# Altium project Bison-Board-PCB-V1.4.PrjPcb
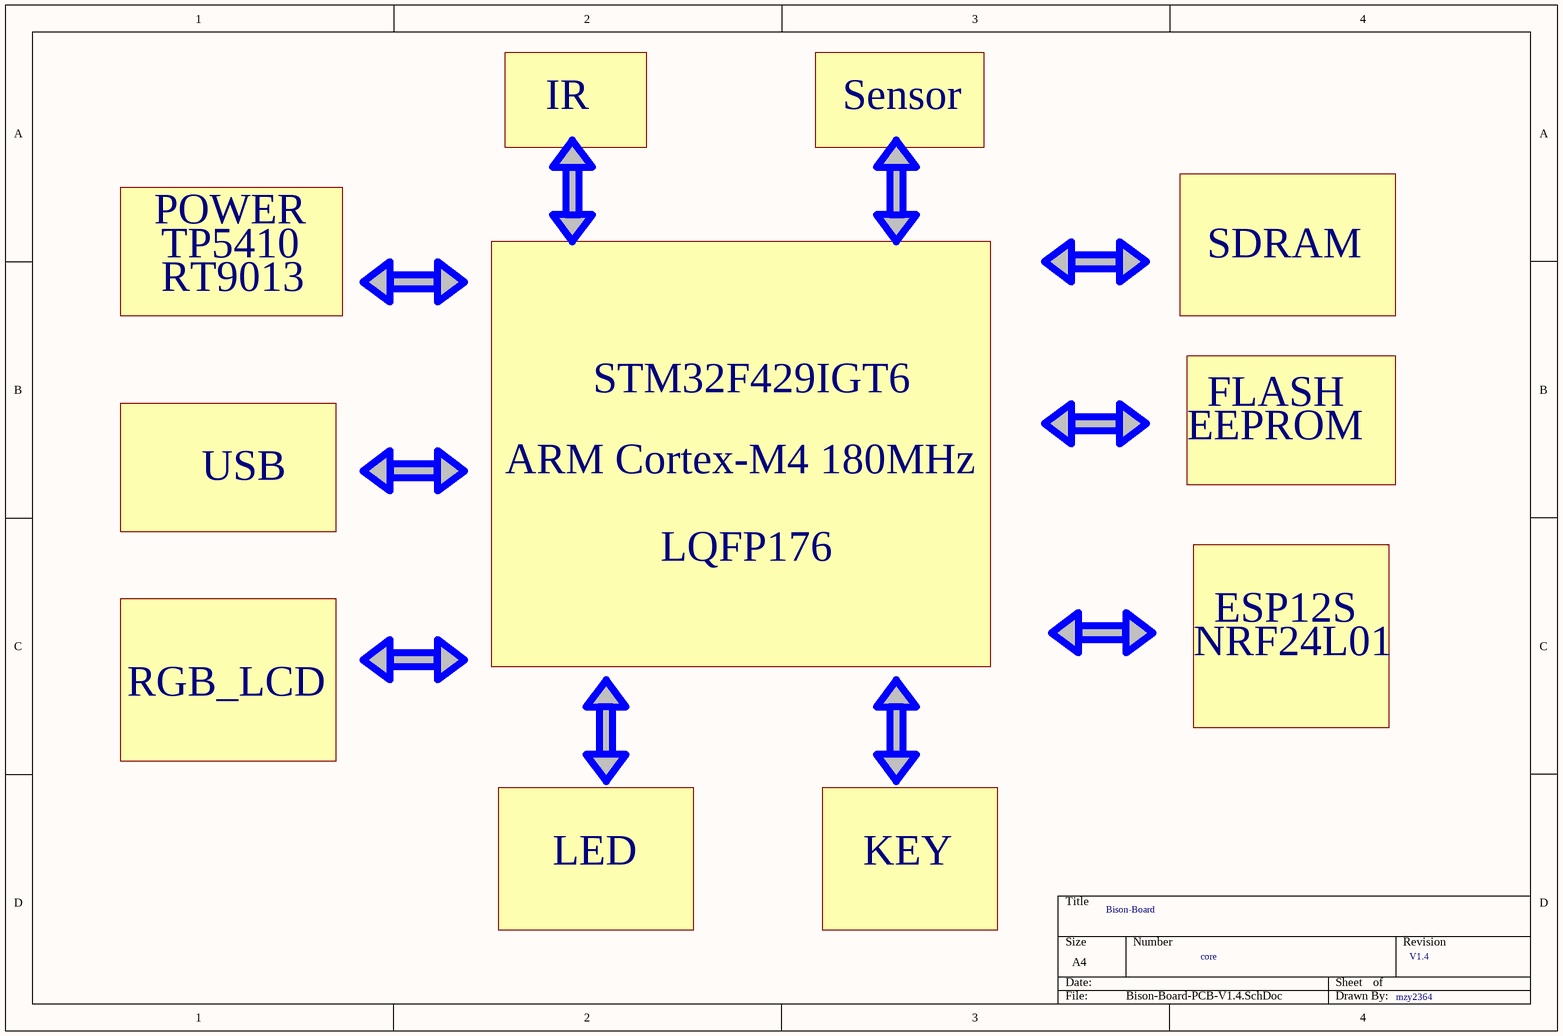
[diagram p0: Bison-Board-PCB-V1.4.SchDoc]
10 sheets, 213 parts. Net scope: global (net labels, ports and power ports of the same name join across sheets).
Board files: Bison-Board-PCB-V1.4.PcbDoc, Bison-Board-PCB-V1.4-sample.PcbDoc
Sheets:
  Bison-Board-PCB-V1.4.SchDoc
  MCU.SchDoc
  POWER.SchDoc
  USB.SchDoc
  SDRAM.SchDoc
  memory.SchDoc
  LCD.SchDoc
  wireless.SchDoc
  sensor.SchDoc
  connect.SchDoc

## Sheet Bison-Board-PCB-V1.4.SchDoc: Bison-Board
size A4; DrawnBy: mzy2364; Revision: V1.4

### Notes on the sheet
- IR
- Sensor
- POWER
- TP5410
- RT9013
- SDRAM
- STM32F429IGT6
- EEPROM
- FLASH
- USB
- ARM Cortex-M4 180MHz
- LQFP176
- ESP12S
- RGB_LCD
- NRF24L01
- LED
- KEY
- core

## Sheet MCU.SchDoc: Bison-Board
size A4; DrawnBy: mzy2364; Revision: V1.4
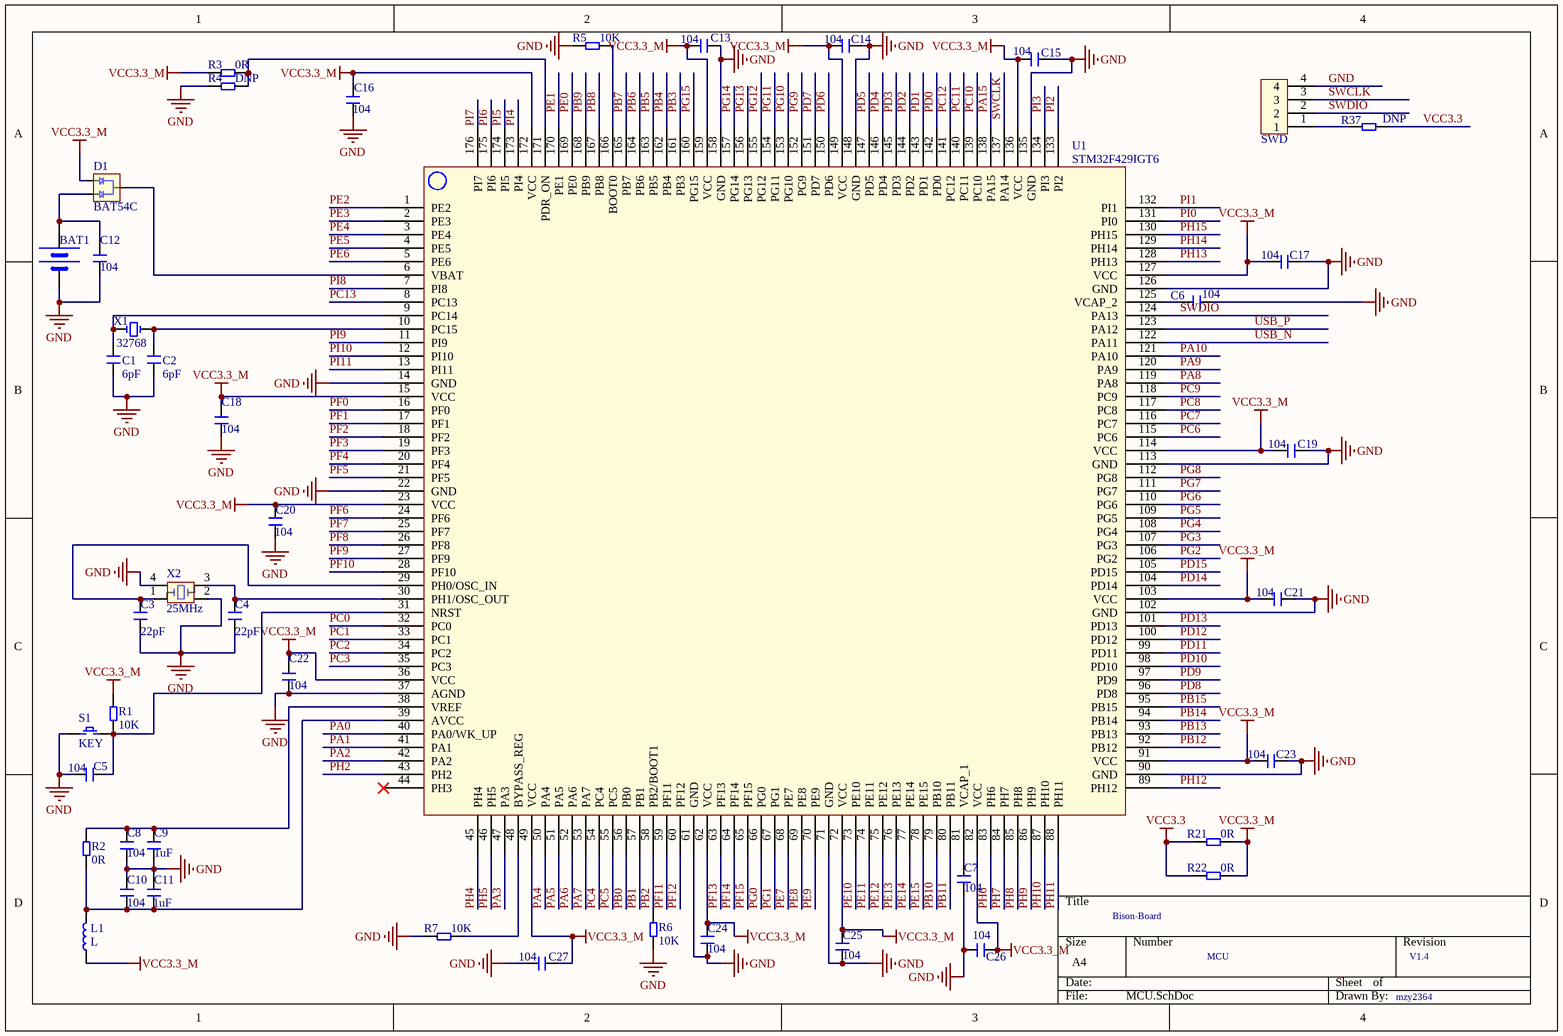
[diagram p1: MCU.SchDoc]

### Parts
BAT1  BATTERY  [SBAT-1220]  (value not drawn)
C1  6pF  [C 0603]
C2  6pF  [C 0603]
C3  22pF  [C 0603]
C4  22pF  [C 0603]
C5  104  [C 0603]
C6  104  [C 0603]
C7  104  [C 0603]
C8  104  [C 0603]
C9  1uF  [C 0603]
C10  104  [C 0603]
C11  1uF  [C 0603]
C12  104  [C 0603]
C13  104  [C 0603]
C14  104  [C 0603]
C15  104  [C 0603]
C16  104  [C 0603]
C17  104  [C 0603]
C18  104  [C 0603]
C19  104  [C 0603]
C20  104  [C 0603]
C21  104  [C 0603]
C22  104  [C 0603]
C23  104  [C 0603]
C24  104  [C 0603]
C25  104  [C 0603]
C26  104  [C 0603]
C27  104  [C 0603]
D1  BAT54C  [SOT23-3]
L1  L  [L 0603]
R1  10K  [R 0603]
R2  0R  [R 0603]
R3  0R  [R 0603]
R4  DNP  [R 0603]
R5  10K  [R 0603]
R6  10K  [R 0603]
R7  10K  [R 0603]
R21  0R  [R 0603]
R22  0R  [R 0603]
R37  DNP  [R 0603]
S1  KEY  [KEY SMD-3*6*2.5]
SWD  Header 4  [XH2.54-LS-4P]  (value not drawn)
U1  STM32F429IGT6  [STM32F429IG]
X1  32768  [XTAL-3215]
X2  25MHz  [XTAL-3225]

### Nets
GND: BAT1.2(GND) C1.1 C2.1 C3.1 C4.1 C5.2 C6.2 C7.1 C8.1 C9.1 C10.2 C11.2 C12.2 C13.1 C14.1 C15.1 C16.2 C17.1 C18.1 C19.1 C20.1 C21.1 C22.1 C23.1 C24.1 C25.1 C26.2 C27.2 R4.2 R5.2 R6.1 R7.2 S1.1 SWD.4 U1.14(GND) U1.22(GND) U1.37(AGND) U1.61(GND) U1.71(GND) U1.90(GND) U1.102(GND) U1.113(GND) U1.126(GND) U1.135(GND) U1.148(GND) U1.158(GND) X2.2 X2.4
VCC3.3: R21.1 R22.1 R37.2
VCC3.3_M: C13.2 C14.2 C15.2 C16.1 C17.2 C18.2 C19.2 C20.2 C21.2 C22.2 C23.2 C24.2 C25.2 C26.1 C27.1 D1.1 L1.2 R1.2 R3.2 R21.2 R22.2 U1.15(VCC) U1.23(VCC) U1.36(VCC) U1.49(VCC) U1.62(VCC) U1.72(VCC) U1.82(VCC) U1.91(VCC) U1.103(VCC) U1.114(VCC) U1.127(VCC) U1.136(VCC) U1.149(VCC) U1.159(VCC) U1.172(VCC)
PA0: U1.40(PA0/WK_UP)
PA1: U1.41(PA1)  [project net LCD_PWM]
PA2: U1.42(PA2)  [project net BEEP]
PA3: U1.47(PA3)
PA4: U1.50(PA4)
PA5: U1.51(PA5)
PA6: U1.52(PA6)
PA7: U1.53(PA7)  [project net LCD_RESET]
PA8: U1.119(PA8)  [project net ESP_RST]
PA9: U1.120(PA9)
PA10: U1.121(PA10)
PA15: U1.138(PA15)  [project net LED_R]
PB0: U1.56(PB0)  [project net LCD_SPI_SDI]
PB1: U1.57(PB1)  [project net IR_IN]
PB2: R6.2 U1.58(PB2/BOOT1)
PB3: U1.161(PB3)
PB4: U1.162(PB4)
PB5: U1.163(PB5)
PB6: U1.164(PB6)
PB7: U1.165(PB7)
PB8: U1.167(PB8)
PB9: U1.168(PB9)
PB10: U1.79(PB10)
PB11: U1.80(PB11)
PB12: U1.92(PB12)
PB13: U1.93(PB13)
PB14: U1.94(PB14)
PB15: U1.95(PB15)
PC0: U1.32(PC0)  [project net FMC_SDNWE]
PC1: U1.33(PC1)  [project net ADC123_IN11]
PC2: U1.34(PC2)  [project net FMC_SDNE0]
PC3: U1.35(PC3)  [project net FMC_SDCKE0]
PC4: U1.54(PC4)  [project net LCD_SPI_CS]
PC5: U1.55(PC5)  [project net LCD_SPI_SCL]
PC6: U1.115(PC6)  [project net ESP_RX]
PC7: U1.116(PC7)  [project net ESP_TX]
PC8: U1.117(PC8)
PC9: U1.118(PC9)
PC10: U1.139(PC10)
PC11: U1.140(PC11)
PC12: U1.141(PC12)
PC13: U1.8(PC13)
PD0: U1.142(PD0)  [project net FMC_D2]
PD1: U1.143(PD1)  [project net FMC_D3]
PD2: U1.144(PD2)
PD3: U1.145(PD3)  [project net LED_B]
PD4: U1.146(PD4)  [project net LED_G]
PD5: U1.147(PD5)
PD6: U1.150(PD6)
PD7: U1.151(PD7)
PD8: U1.96(PD8)  [project net FMC_D13]
PD9: U1.97(PD9)  [project net FMC_D14]
PD10: U1.98(PD10)  [project net FMC_D15]
PD11: U1.99(PD11)  [project net NRF_CE]
PD12: U1.100(PD12)  [project net NRF_CS]
PD13: U1.101(PD13)  [project net NRF_IRQ]
PD14: U1.104(PD14)  [project net FMC_D0]
PD15: U1.105(PD15)  [project net FMC_D1]
PE0: U1.169(PE0)  [project net FMC_NBL0]
PE1: U1.170(PE1)  [project net FMC_NBL1]
PE2: U1.1(PE2)
PE3: U1.2(PE3)
PE4: U1.3(PE4)
PE5: U1.4(PE5)
PE6: U1.5(PE6)
PE7: U1.68(PE7)  [project net FMC_D4]
PE8: U1.69(PE8)  [project net FMC_D5]
PE9: U1.70(PE9)  [project net FMC_D6]
PE10: U1.73(PE10)  [project net FMC_D7]
PE11: U1.74(PE11)  [project net FMC_D8]
PE12: U1.75(PE12)  [project net FMC_D9]
PE13: U1.76(PE13)  [project net FMC_D10]
PE14: U1.77(PE14)  [project net FMC_D11]
PE15: U1.78(PE15)  [project net FMC_D12]
PF0: U1.16(PF0)  [project net FMC_A0]
PF1: U1.17(PF1)  [project net FMC_A1]
PF2: U1.18(PF2)  [project net FMC_A2]
PF3: U1.19(PF3)  [project net FMC_A3]
PF4: U1.20(PF4)  [project net FMC_A4]
PF5: U1.21(PF5)  [project net FMC_A5]
PF6: U1.24(PF6)
PF7: U1.25(PF7)
PF8: U1.26(PF8)  [project net ADC3_IN6]
PF9: U1.27(PF9)  [project net ADC3_IN7]
PF10: U1.28(PF10)  [project net LCD_DE]
PF11: U1.59(PF11)  [project net FMC_SDNRAS]
PF12: U1.60(PF12)  [project net FMC_A6]
PF13: U1.63(PF13)  [project net FMC_A7]
PF14: U1.64(PF14)  [project net FMC_A8]
PF15: U1.65(PF15)  [project net FMC_A9]
PG0: U1.66(PG0)  [project net FMC_A10]
PG1: U1.67(PG1)  [project net FMC_A11]
PG2: U1.106(PG2)  [project net FMC_A12]
PG3: U1.107(PG3)  [project net ESP_EN]
PG4: U1.108(PG4)  [project net FMC_BA0]
PG5: U1.109(PG5)  [project net FMC_BA1]
PG6: U1.110(PG6)  [project net LCD_R7]
PG7: U1.111(PG7)  [project net LCD_CLK]
PG8: U1.112(PG8)  [project net FMC_SDCLK]
PG9: U1.152(PG9)
PG10: U1.153(PG10)
PG11: U1.154(PG11)  [project net LCD_B3]
PG12: U1.155(PG12)  [project net FLASH_SPI_MISO]
PG13: U1.156(PG13)  [project net FLASH_SPI_CLK]
PG14: U1.157(PG14)  [project net FLASH_SPI_MOSI]
PG15: U1.160(PG15)  [project net FMC_SDNCAS]
PH2: U1.43(PH2)
PH4: U1.45(PH4)  [project net NRF_PWR_EN]
PH5: U1.46(PH5)  [project net CHRG]
PH6: U1.83(PH6)  [project net MPU_INT]
PH7: U1.84(PH7)  [project net I2C3_SCL]
PH8: U1.85(PH8)  [project net I2C3_SDA]
PH9: U1.86(PH9)  [project net LCD_R3]
PH10: U1.87(PH10)  [project net LCD_R4]
PH11: U1.88(PH11)  [project net LCD_R5]
PH12: U1.89(PH12)  [project net LCD_R6]
PH13: U1.128(PH13)  [project net LCD_G2]
PH14: U1.129(PH14)  [project net LCD_G3]
PH15: U1.130(PH15)  [project net LCD_G4]
PI0: U1.131(PI0)  [project net LCD_G5]
PI1: U1.132(PI1)  [project net LCD_G6]
PI2: U1.133(PI2)  [project net LCD_G7]
PI3: U1.134(PI3)  [project net IR]
PI4: U1.173(PI4)  [project net LCD_B4]
PI5: U1.174(PI5)  [project net LCD_B5]
PI6: U1.175(PI6)  [project net LCD_B6]
PI7: U1.176(PI7)  [project net LCD_B7]
PI8: U1.7(PI8)  [project net FLASH_CS]
PI9: U1.11(PI9)  [project net LCD_VSYNC]
PI10: U1.12(PI10)  [project net LCD_HSYNC]
PI11: U1.13(PI11)
SWCLK: SWD.3 U1.137(PA14)
SWDIO: SWD.2 U1.124(PA13)
USB_N: U1.122(PA11)
USB_P: U1.123(PA12)
NetBAT1_1: BAT1.1(VCC) C12.1 D1.2
NetC1_2: C1.2 U1.9(PC14) X1.1
NetC2_2: C2.2 U1.10(PC15) X1.2
NetC3_2: C3.2 U1.29(PH0/OSC_IN) X2.1
NetC4_2: C4.2 U1.30(PH1/OSC_OUT) X2.3
NetC5_1: C5.1 R1.1 S1.2 U1.31(NRST)
NetC6_1: C6.1 U1.125(VCAP_2)
NetC7_2: C7.2 U1.81(VCAP_1)
NetC8_2: C8.2 C9.2 R2.2 U1.38(VREF)
NetC10_1: C10.1 C11.1 L1.1 R2.1 U1.39(AVCC)
NetD1_3: D1.3 U1.6(VBAT)
NetR3_1: R3.1 R4.1 U1.171(PDR_ON)
NetR5_1: R5.1 U1.166(BOOT0)
NetR7_1: R7.1 U1.48(BYPASS_REG)
NetR37_1: R37.1 SWD.1

Not connected (* = marked no-connect by the designer): U1 44(PH3)*

### Notes on the sheet
- MCU

### Library data of the parts
C1-C27 = CAP
R1-R7 R21 R22 R37 = RES
X1 = XTAL-2P
X2 = XTAL-4P

## Sheet POWER.SchDoc: Bison-Board
size A4; DrawnBy: mzy2364; Revision: V1.4
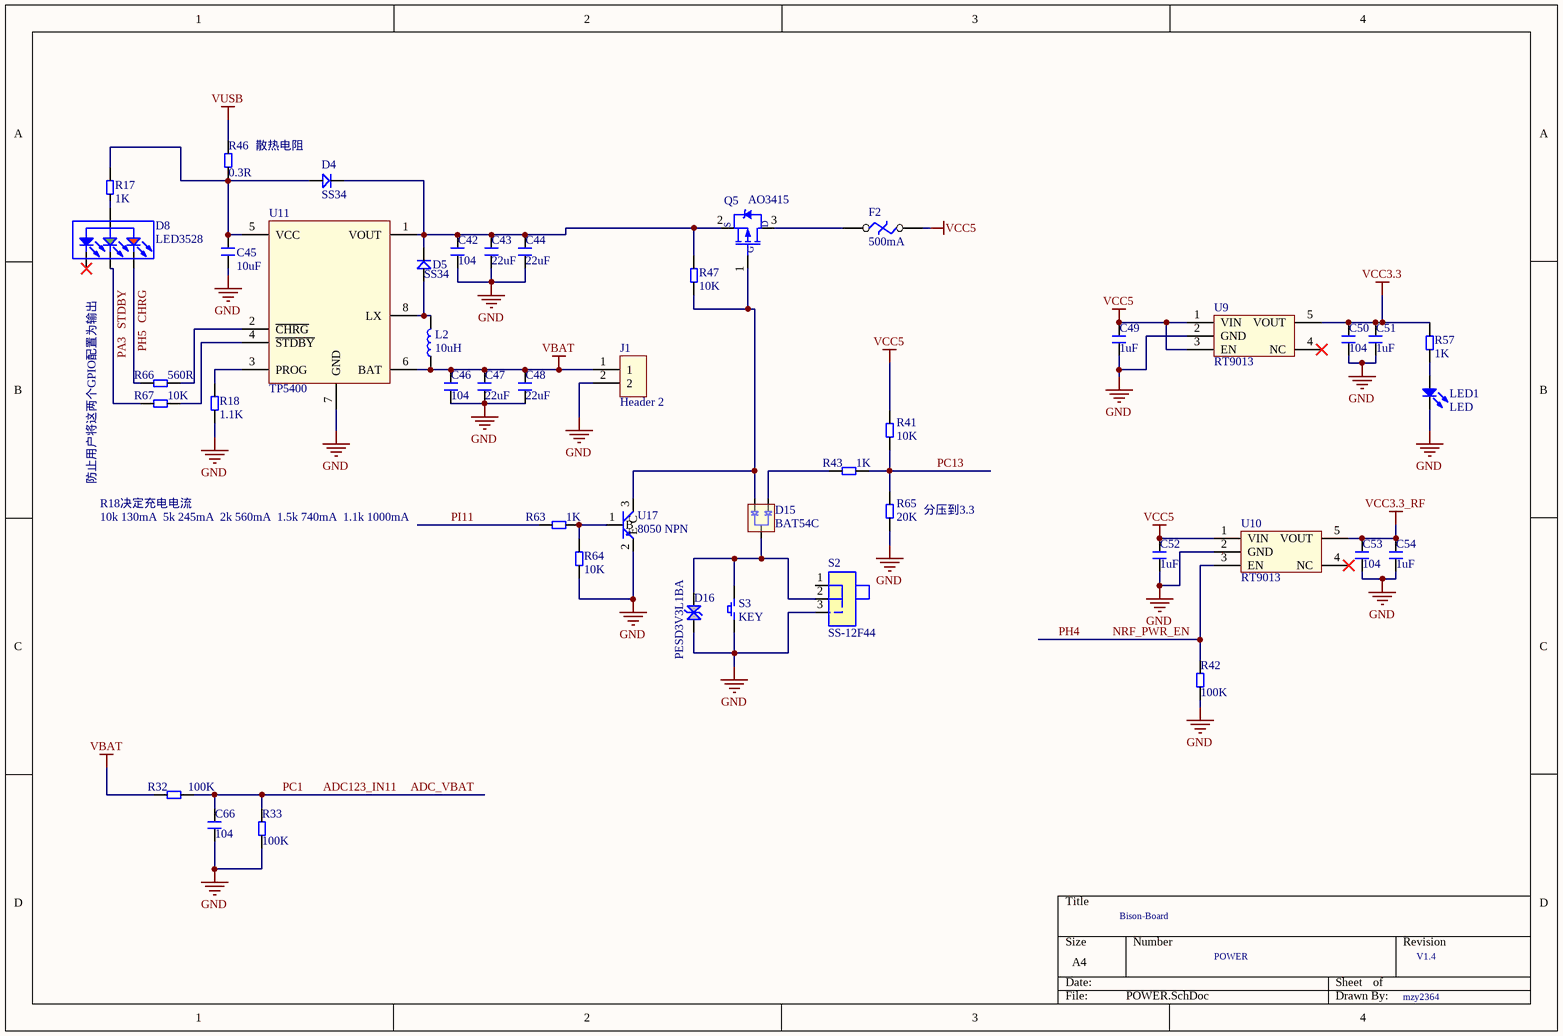
[diagram p2: POWER.SchDoc]

### Parts
C42  104  [C 0603]
C43  22uF  [C 0805]
C44  22uF  [C 0805]
C45  10uF  [C 0805]
C46  104  [C 0603]
C47  22uF  [C 0805]
C48  22uF  [C 0805]
C49  1uF  [C 0603]
C50  104  [C 0603]
C51  1uF  [C 0603]
C52  1uF  [C 0603]
C53  104  [C 0603]
C54  1uF  [C 0603]
C66  104  [C 0603]
D4  SS34  [SMA]
D5  SS34  [SMA]
D8  LED3528  [LED3528-4PIN]
D15  BAT54C  [SOT23-3]
D16  PESD3V3L1BA  [SOD323]
F2  500mA  [F 0805]
J1  Header 2  [XH2.54-WS-2P]
L2  10uH  [L_SMNR4030]
LED1  LED  [LED0603]
Q5  AO3415  [SOT23-3]
R17  1K  [R 0603]
R18  1.1K  [R 0603]
R32  100K  [R 0603]
R33  100K  [R 0603]
R41  10K  [R 0603]
R42  100K  [R 0603]
R43  1K  [R 0603]
R46  0.3R  [R 0805]
R47  10K  [R 0603]
R57  1K  [R 0603]
R63  1K  [R 0603]
R64  10K  [R 0603]
R65  20K  [R 0603]
R66  560R  [R 0603]
R67  10K  [R 0603]
S2  SS-12F44  [K3-1280S-L1]
S3  KEY  [KEY-TC-153]
U9  RT9013  [SOT23-5]
U10  RT9013  [SOT23-5]
U11  TP5400  [TP5410]
U17  8050 NPN  [SOT23-3]

### Nets
GND: C42.1 C43.1 C44.1 C45.1 C46.1 C47.1 C48.1 C49.1 C50.1 C51.1 C52.1 C53.1 C54.1 C66.1 D16.1 J1.2 LED1.2(K) R18.1 R33.2 R42.1 R64.2 R65.2 S2.3 S3.1 U9.2(GND) U10.2(GND) U11.7(GND) U17.2(E)
VBAT: C46.2 C47.2 C48.2 J1.1 L2.2 R32.2 U11.6(BAT)
VCC3.3: C50.2 C51.2 R57.2 U9.5(VOUT)
VCC3.3_RF: C53.2 C54.2 U10.5(VOUT)
VCC5: C49.2 C52.2 F2.1 R41.1 U9.1(VIN) U9.3(EN) U10.1(VIN)
VUSB: R46.2
ADC123_IN11: C66.2 R32.1 R33.1  [also labelled ADC_VBAT, PC1]
CHRG: D8.1(R) R66.2  [also labelled PH5]
NRF_PWR_EN: R42.2 U10.3(EN)  [also labelled PH4]
PA3: D8.4(G) R67.2  [also labelled STDBY]
PC13: R41.2 R43.1 R65.1
PI11: R63.2
NetC42_2: C42.2 C43.2 C44.2 D4.2 D5.2 Q5.2(S) R47.1 U11.1(VOUT)
NetC45_2: C45.2 D4.1 R17.2 R46.1 U11.5(VCC)
NetD5_1: D5.1 L2.1 U11.8(LX)
NetD8_2: D8.2(+) R17.1
NetD15_1: D15.1 R43.2
NetD15_2: D15.2 Q5.1(G) R47.2 U17.3(C)
NetD15_3: D15.3 D16.2 S2.2 S3.2
NetF2_2: F2.2 Q5.3(D)
NetLED1_1: LED1.1(A) R57.1
NetR18_2: R18.2 U11.3(PROG)
NetR63_1: R63.1 R64.1 U17.1(B)
NetR66_1: R66.1 U11.2(~{CHRG})
NetR67_1: R67.1 U11.4(~{STDBY})

Not connected (* = marked no-connect by the designer): D8 3(B)*; S2 1; U9 4(NC)*; U10 4(NC)*

### Notes on the sheet
- (near R46) 散热电阻
- 10k 130mA  5k 245mA  2k 560mA  1.5k 740mA  1.1k 1000mA
- 防止用户将这两个GPIO配置为输出
- R18决定充电电流
- (near R65) 分压到3.3
- POWER

### Library data of the parts
C42-C54 C66 = CAP
D4 D5 = Diode
D16 = D Schottky1: 双向TVS
F2 = F: 熔断开关
L2 = L
Q5 = PMOS-2
R17 R18 R32 R33 R41-R43 R46 R47 R57 R63-R67 = RES
S2 = SWITCH
U9 U10 = RT9013: 500mA低压差LDO
U11 = TP5410
U17 = NPN

## Sheet USB.SchDoc: Bison-Board
size A4; DrawnBy: mzy2364; Revision: V1.4
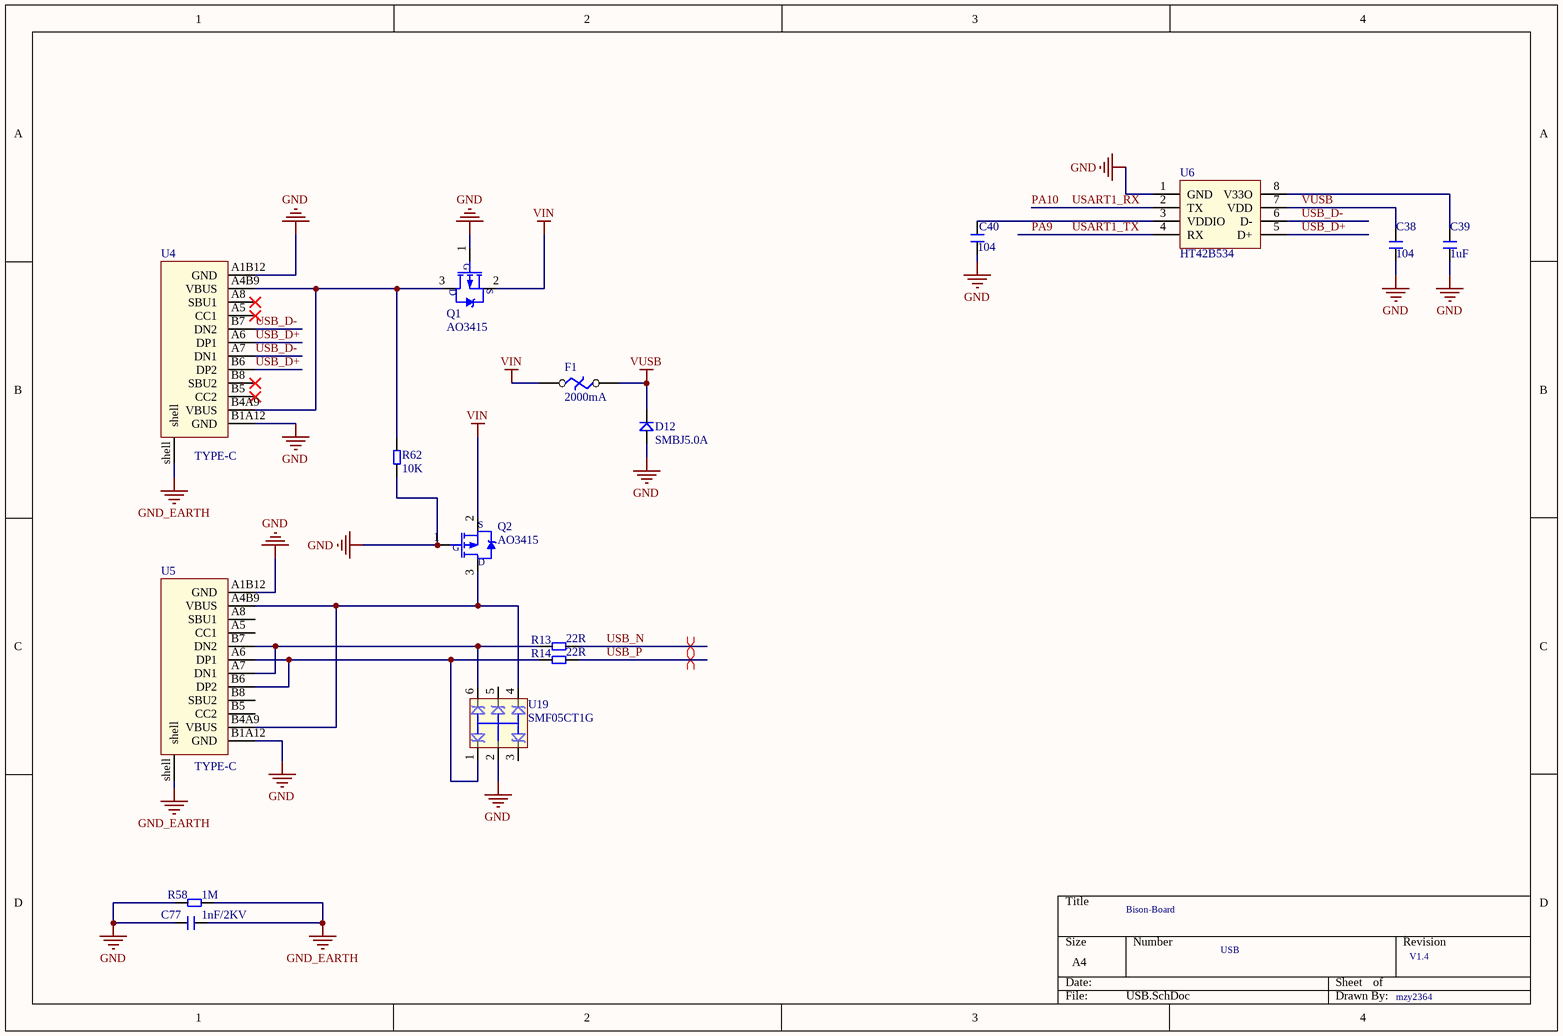
[diagram p3: USB.SchDoc]

### Parts
C38  104  [C 0603]
C39  1uF  [C 0603]
C40  104  [C 0603]
C77  1nF/2KV  [C 1206]
D12  SMBJ5.0A  [SMA]
F1  2000mA  [F 0805]
Q1  AO3415  [SOT23-3]
Q2  AO3415  [SOT23-3]
R13  22R  [R 0603]
R14  22R  [R 0603]
R58  1M  [R 1206]
R62  10K  [R 0603]
U4  TYPE-C  [USB-TYPE-C]
U5  TYPE-C  [USB-TYPE-C]
U6  HT42B534  [SOP8]
U19  SMF05CT1G  [SOT363]

### Nets
GND: C38.1 C39.2 C40.1 C77.1 D12.1 Q1.1(G) Q2.1(G) R58.1 R62.1 U4.A1B12(GND) U4.B1A12(GND) U5.A1B12(GND) U5.B1A12(GND) U6.1(GND) U19.2
GND_EARTH: C77.2 R58.2 U4.shell U5.shell
VIN: F1.1 Q1.2(S) Q2.2(S)
VUSB: C38.2 D12.2 F1.2 U6.7(VDD)
PA9: U6.4(RX)  [also labelled USART1_TX]
PA10: U6.2(TX)  [also labelled USART1_RX]
USB_D+: U4.A6(DP1) U4.B6(DP2) U6.5(D+)
USB_D-: U4.A7(DN1) U4.B7(DN2) U6.6(D-)
USB_N: R13.2
USB_P: R14.2
NetC39_1: C39.1 U6.8(V33O)
NetC40_2: C40.2 U6.3(VDDIO)
NetQ1_3: Q1.3(D) R62.2 U4.A4B9(VBUS) U4.B4A9(VBUS)
NetQ2_3: Q2.3(D) U5.A4B9(VBUS) U5.B4A9(VBUS) U19.4
NetR13_1: R13.1 U5.A7(DN1) U5.B7(DN2) U19.6
NetR14_1: R14.1 U5.A6(DP1) U5.B6(DP2) U19.1

Not connected (* = marked no-connect by the designer): U4 A5(CC1)* A8(SBU1)* B5(CC2)* B8(SBU2)*; U5 A5(CC1) A8(SBU1) B5(CC2) B8(SBU2); U19 3 5

### Layout directives
differential pair: USB_N, USB_P

### Notes on the sheet
- USB

### Library data of the parts
C38-C40 C77 = CAP
D12 = Diode
F1 = F: 熔断开关
Q1 Q2 = PMOS-2
R13 R14 R58 R62 = RES
U4 U5 = USB TYPE-C: TYPE-C 16pin
U6 = HT42B534: USB转串口
U19 = SMF05CT1G: TVS

## Sheet SDRAM.SchDoc: Bison-Board
size A4; DrawnBy: mzy2364; Revision: V1.4
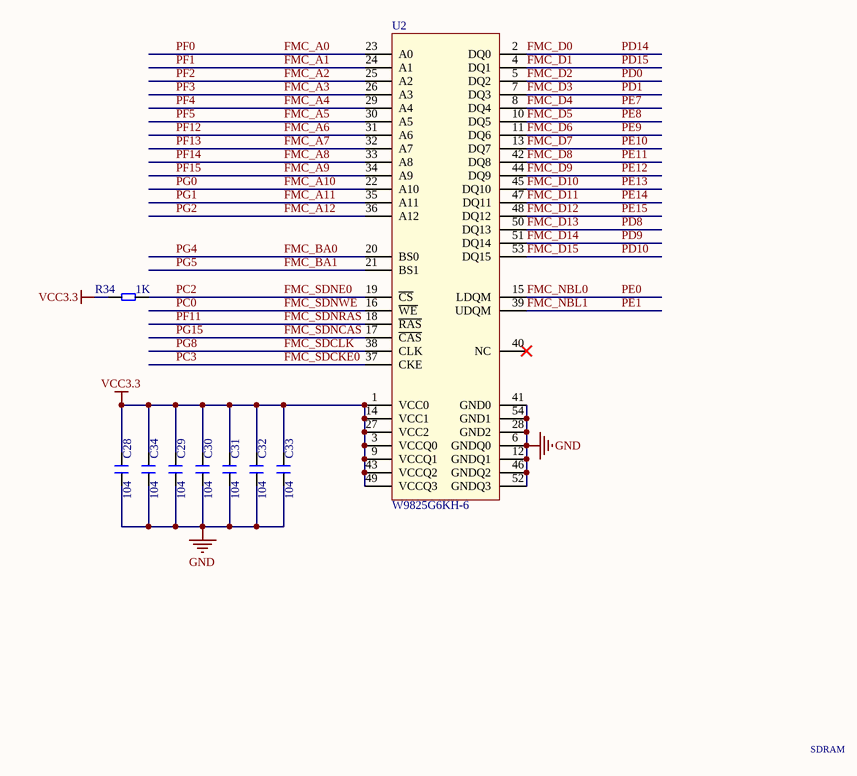
[diagram p4: SDRAM.SchDoc]

### Parts
C28  104  [C 0603]
C29  104  [C 0603]
C30  104  [C 0603]
C31  104  [C 0603]
C32  104  [C 0603]
C33  104  [C 0603]
C34  104  [C 0603]
R34  1K  [R 0603]
U2  W9825G6KH-6  [TSOP54]

### Nets
GND: C28.1 C29.1 C30.1 C31.1 C32.1 C33.1 C34.2 U2.6(GNDQ0) U2.12(GNDQ1) U2.28(GND2) U2.41(GND0) U2.46(GNDQ2) U2.52(GNDQ3) U2.54(GND1)
VCC3.3: C28.2 C29.2 C30.2 C31.2 C32.2 C33.2 C34.1 R34.1 U2.1(VCC0) U2.3(VCCQ0) U2.9(VCCQ1) U2.14(VCC1) U2.27(VCC2) U2.43(VCCQ2) U2.49(VCCQ3)
FMC_A0: U2.23(A0)  [also labelled PF0]
FMC_A1: U2.24(A1)  [also labelled PF1]
FMC_A2: U2.25(A2)  [also labelled PF2]
FMC_A3: U2.26(A3)  [also labelled PF3]
FMC_A4: U2.29(A4)  [also labelled PF4]
FMC_A5: U2.30(A5)  [also labelled PF5]
FMC_A6: U2.31(A6)  [also labelled PF12]
FMC_A7: U2.32(A7)  [also labelled PF13]
FMC_A8: U2.33(A8)  [also labelled PF14]
FMC_A9: U2.34(A9)  [also labelled PF15]
FMC_A10: U2.22(A10)  [also labelled PG0]
FMC_A11: U2.35(A11)  [also labelled PG1]
FMC_A12: U2.36(A12)  [also labelled PG2]
FMC_BA0: U2.20(BS0)  [also labelled PG4]
FMC_BA1: U2.21(BS1)  [also labelled PG5]
FMC_D0: U2.2(DQ0)  [also labelled PD14]
FMC_D1: U2.4(DQ1)  [also labelled PD15]
FMC_D2: U2.5(DQ2)  [also labelled PD0]
FMC_D3: U2.7(DQ3)  [also labelled PD1]
FMC_D4: U2.8(DQ4)  [also labelled PE7]
FMC_D5: U2.10(DQ5)  [also labelled PE8]
FMC_D6: U2.11(DQ6)  [also labelled PE9]
FMC_D7: U2.13(DQ7)  [also labelled PE10]
FMC_D8: U2.42(DQ8)  [also labelled PE11]
FMC_D9: U2.44(DQ9)  [also labelled PE12]
FMC_D10: U2.45(DQ10)  [also labelled PE13]
FMC_D11: U2.47(DQ11)  [also labelled PE14]
FMC_D12: U2.48(DQ12)  [also labelled PE15]
FMC_D13: U2.50(DQ13)  [also labelled PD8]
FMC_D14: U2.51(DQ14)  [also labelled PD9]
FMC_D15: U2.53(DQ15)  [also labelled PD10]
FMC_NBL0: U2.15(LDQM)  [also labelled PE0]
FMC_NBL1: U2.39(UDQM)  [also labelled PE1]
FMC_SDCKE0: U2.37(CKE)  [also labelled PC3]
FMC_SDCLK: U2.38(CLK)  [also labelled PG8]
FMC_SDNCAS: U2.17(~{CAS})  [also labelled PG15]
FMC_SDNE0: R34.2 U2.19(~{CS})  [also labelled PC2]
FMC_SDNRAS: U2.18(~{RAS})  [also labelled PF11]
FMC_SDNWE: U2.16(~{WE})  [also labelled PC0]

Not connected (* = marked no-connect by the designer): U2 40(NC)*

### Notes on the sheet
- SDRAM

### Library data of the parts
C28-C34 = CAP
R34 = RES

## Sheet memory.SchDoc: Bison-Board
size A4; DrawnBy: mzy2364; Revision: V1.4
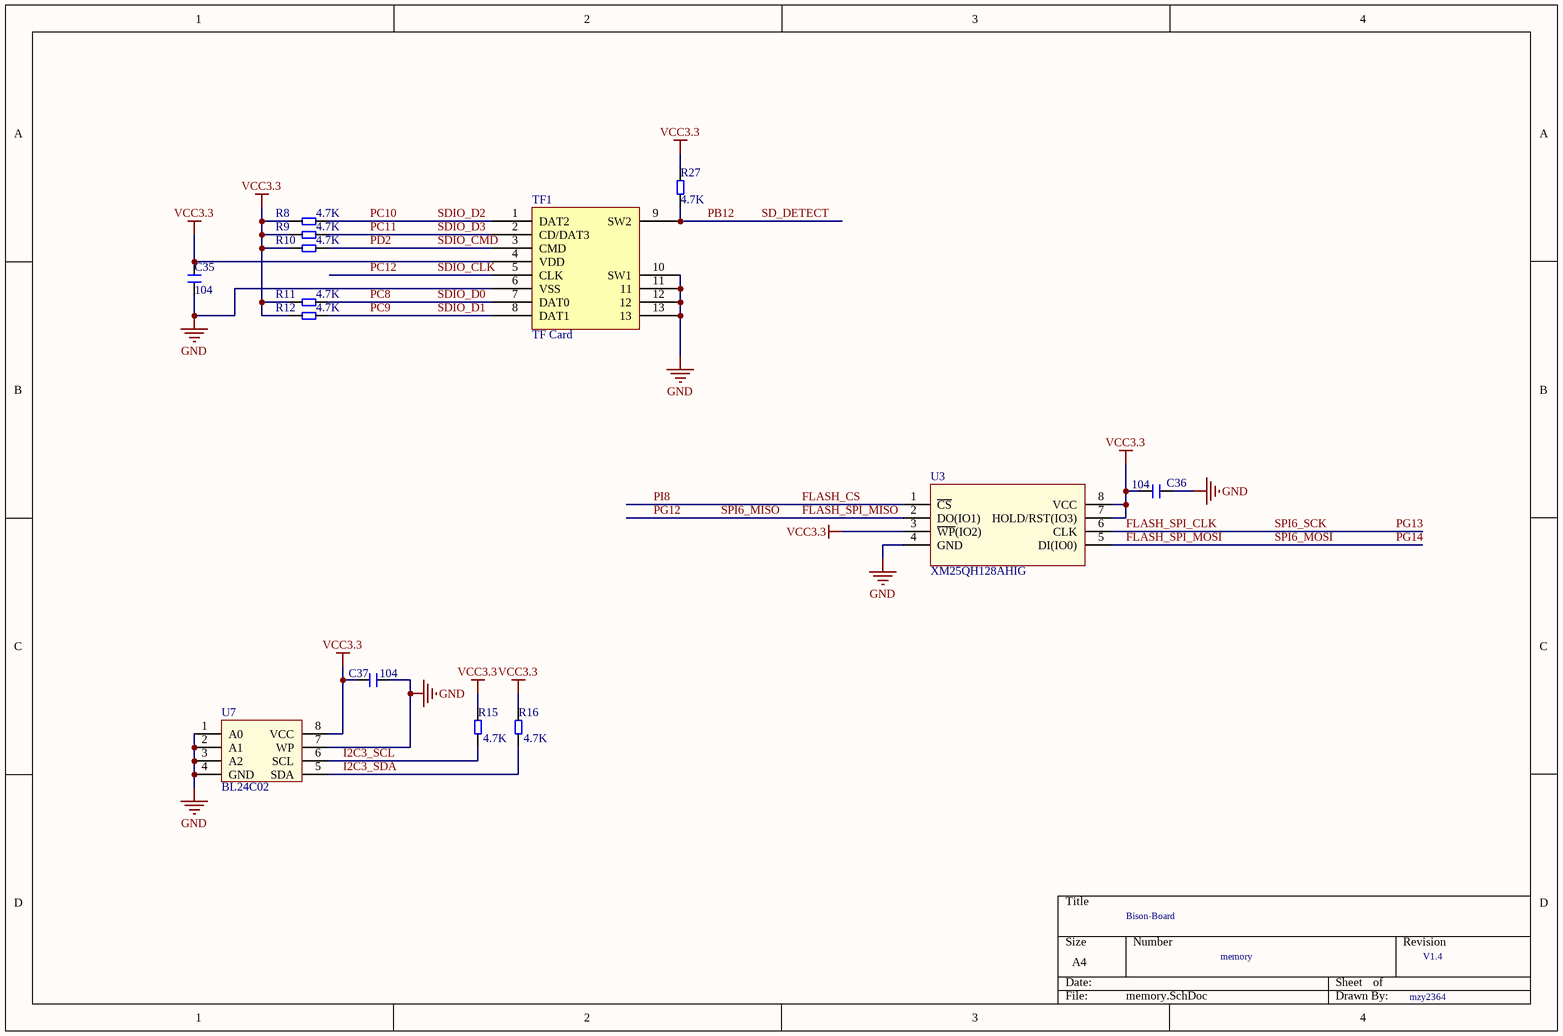
[diagram p5: memory.SchDoc]

### Parts
C35  104  [C 0603]
C36  104  [C 0603]
C37  104  [C 0603]
R8  4.7K  [R 0603]
R9  4.7K  [R 0603]
R10  4.7K  [R 0603]
R11  4.7K  [R 0603]
R12  4.7K  [R 0603]
R15  4.7K  [R 0603]
R16  4.7K  [R 0603]
R27  4.7K  [R 0603]
TF1  TF Card  [TF Card]
U3  XM25QH128AHIG  [SOIC-8-208mil]
U7  BL24C02  [SOP8]

### Nets
GND: C35.1 C36.2 C37.2 TF1.6(VSS) TF1.10(SW1) TF1.11 TF1.12 TF1.13 U3.4(GND) U7.1(A0) U7.2(A1) U7.3(A2) U7.4(GND) U7.7(WP)
VCC3.3: C35.2 C36.1 C37.1 R8.1 R9.1 R10.1 R11.1 R12.1 R15.2 R16.2 R27.2 TF1.4(VDD) U3.3(~{WP}(IO2)) U3.7(HOLD/RST(IO3)) U3.8(VCC) U7.8(VCC)
FLASH_CS: U3.1(~{CS})  [also labelled PI8]
FLASH_SPI_CLK: U3.6(CLK)  [also labelled PG13, SPI6_SCK]
FLASH_SPI_MISO: U3.2(DO(IO1))  [also labelled PG12, SPI6_MISO]
FLASH_SPI_MOSI: U3.5(DI(IO0))  [also labelled PG14, SPI6_MOSI]
I2C3_SCL: R15.1 U7.6(SCL)
I2C3_SDA: R16.1 U7.5(SDA)
PB12: R27.1 TF1.9(SW2)  [also labelled SD_DETECT]
PC8: R11.2 TF1.7(DAT0)  [also labelled SDIO_D0]
PC9: R12.2 TF1.8(DAT1)  [also labelled SDIO_D1]
PC10: R8.2 TF1.1(DAT2)  [also labelled SDIO_D2]
PC11: R9.2 TF1.2(CD/DAT3)  [also labelled SDIO_D3]
PC12: TF1.5(CLK)  [also labelled SDIO_CLK]
PD2: R10.2 TF1.3(CMD)  [also labelled SDIO_CMD]

### Notes on the sheet
- memory

### Library data of the parts
C35-C37 = CAP
R8-R12 R15 R16 R27 = RES
U3 = W25Q128
U7 = 24C02

## Sheet LCD.SchDoc: Bison-Board
size A4; DrawnBy: mzy2364; Revision: V1.4
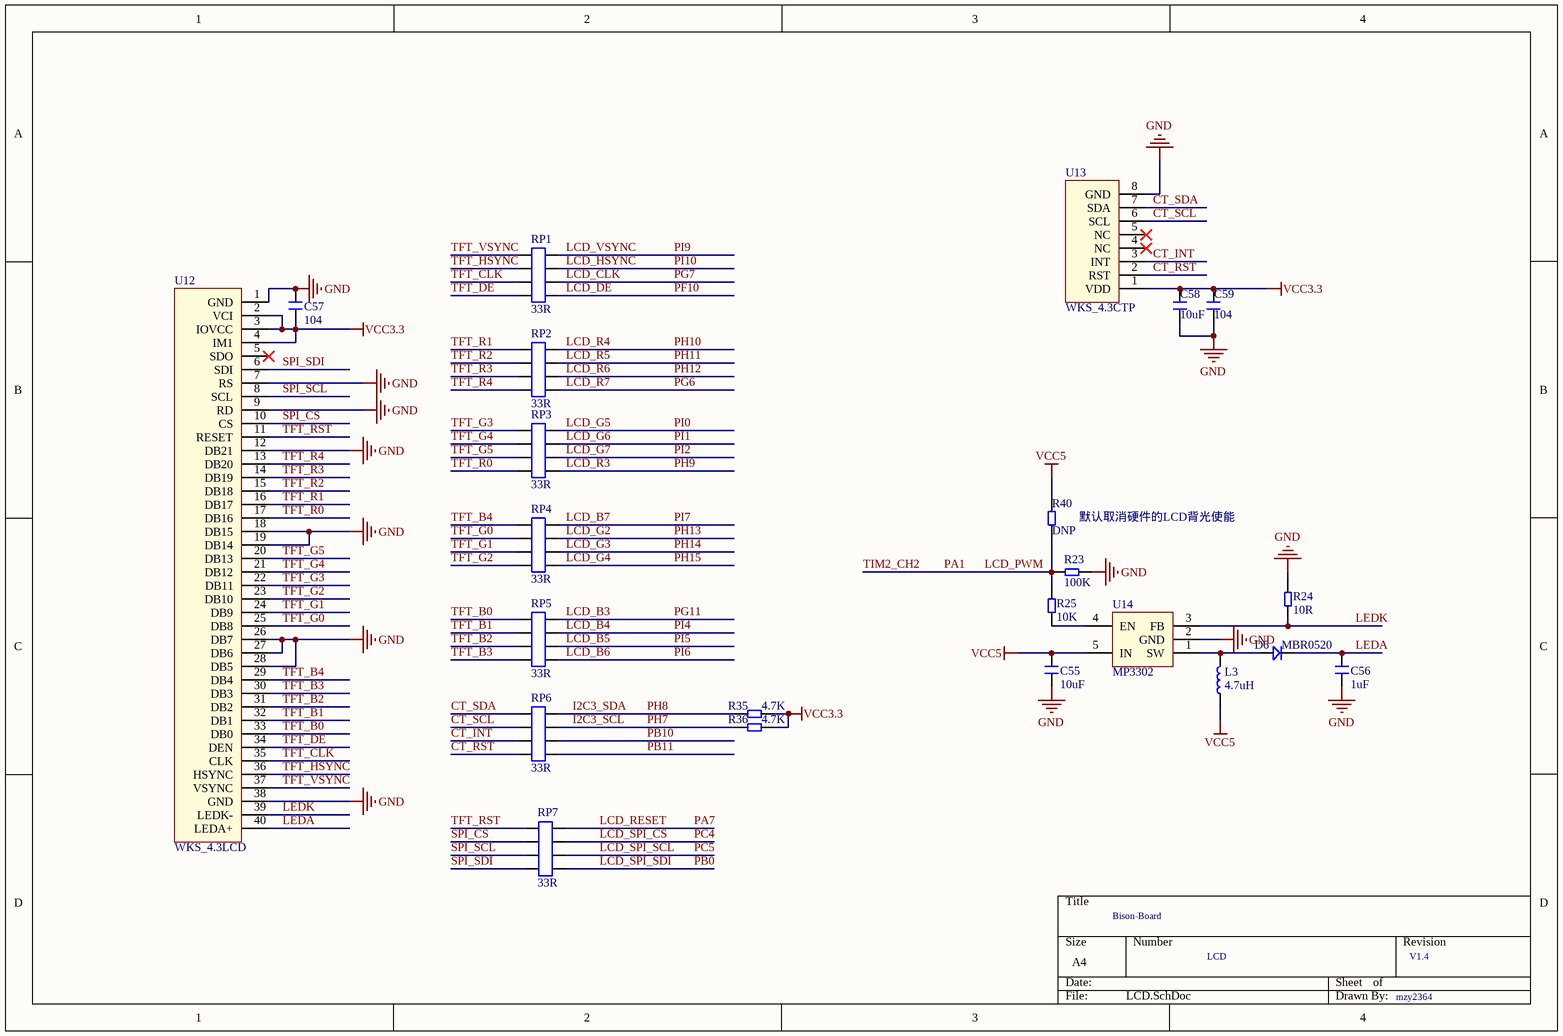
[diagram p6: LCD.SchDoc]

### Parts
C55  10uF  [C 0805]
C56  1uF  [C 0603]
C57  104  [C 0603]
C58  10uF  [C 0805]
C59  104  [C 0603]
D6  MBR0520  [SOD123]
L3  4.7uH  [L_SMNR4030]
R23  100K  [R 0603]
R24  10R  [R 0603]
R25  10K  [R 0603]
R35  4.7K  [R 0603]
R36  4.7K  [R 0603]
R40  DNP  [R 0603]
RP1  33R  [8P4R 0603]
RP2  33R  [8P4R 0603]
RP3  33R  [8P4R 0603]
RP4  33R  [8P4R 0603]
RP5  33R  [8P4R 0603]
RP6  33R  [8P4R 0603]
RP7  33R  [8P4R 0603]
U12  WKS_4.3LCD  [FPC0.5-40P]
U13  WKS_4.3CTP  [FPC0.5-8P]
U14  MP3302  [SOT23-5]

### Nets
GND: C55.1 C56.1 C57.2 C58.1 C59.1 R23.2 R24.2 U12.1(GND) U12.7(RS) U12.9(RD) U12.12(DB21) U12.18(DB15) U12.19(DB14) U12.26(DB7) U12.27(DB6) U12.28(DB5) U12.38(GND) U13.8(GND) U14.2(GND)
VCC3.3: C57.1 C58.2 C59.2 R35.2 R36.2 U12.2(VCI) U12.3(IOVCC) U12.4(IM1) U13.1(VDD)
VCC5: C55.2 L3.2 R40.2 U14.5(IN)
CT_INT: RP6.3 U13.3(INT)
CT_RST: RP6.4 U13.2(RST)
CT_SCL: RP6.2 U13.6(SCL)
CT_SDA: RP6.1 U13.7(SDA)
I2C3_SCL: R36.1 RP6.7  [also labelled PH7]
I2C3_SDA: R35.1 RP6.8  [also labelled PH8]
LCD_B3: RP5.8  [also labelled PG11]
LCD_B4: RP5.7  [also labelled PI4]
LCD_B5: RP5.6  [also labelled PI5]
LCD_B6: RP5.5  [also labelled PI6]
LCD_B7: RP4.8  [also labelled PI7]
LCD_CLK: RP1.6  [also labelled PG7]
LCD_DE: RP1.5  [also labelled PF10]
LCD_G2: RP4.7  [also labelled PH13]
LCD_G3: RP4.6  [also labelled PH14]
LCD_G4: RP4.5  [also labelled PH15]
LCD_G5: RP3.8  [also labelled PI0]
LCD_G6: RP3.7  [also labelled PI1]
LCD_G7: RP3.6  [also labelled PI2]
LCD_HSYNC: RP1.7  [also labelled PI10]
LCD_PWM: R23.1 R25.1 R40.1  [also labelled PA1, TIM2_CH2]
LCD_R3: RP3.5  [also labelled PH9]
LCD_R4: RP2.8  [also labelled PH10]
LCD_R5: RP2.7  [also labelled PH11]
LCD_R6: RP2.6  [also labelled PH12]
LCD_R7: RP2.5  [also labelled PG6]
LCD_RESET: RP7.8  [also labelled PA7]
LCD_SPI_CS: RP7.7  [also labelled PC4]
LCD_SPI_SCL: RP7.6  [also labelled PC5]
LCD_SPI_SDI: RP7.5  [also labelled PB0]
LCD_VSYNC: RP1.8  [also labelled PI9]
LEDA: C56.2 D6.2 U12.40(LEDA+)
LEDK: R24.1 U12.39(LEDK-) U14.3(FB)
PB10: RP6.6
PB11: RP6.5
SPI_CS: RP7.2 U12.10(CS)
SPI_SCL: RP7.3 U12.8(SCL)
SPI_SDI: RP7.4 U12.6(SDI)
TFT_B0: RP5.1 U12.33(DB0)
TFT_B1: RP5.2 U12.32(DB1)
TFT_B2: RP5.3 U12.31(DB2)
TFT_B3: RP5.4 U12.30(DB3)
TFT_B4: RP4.1 U12.29(DB4)
TFT_CLK: RP1.3 U12.35(CLK)
TFT_DE: RP1.4 U12.34(DEN)
TFT_G0: RP4.2 U12.25(DB8)
TFT_G1: RP4.3 U12.24(DB9)
TFT_G2: RP4.4 U12.23(DB10)
TFT_G3: RP3.1 U12.22(DB11)
TFT_G4: RP3.2 U12.21(DB12)
TFT_G5: RP3.3 U12.20(DB13)
TFT_HSYNC: RP1.2 U12.36(HSYNC)
TFT_R0: RP3.4 U12.17(DB16)
TFT_R1: RP2.1 U12.16(DB17)
TFT_R2: RP2.2 U12.15(DB18)
TFT_R3: RP2.3 U12.14(DB19)
TFT_R4: RP2.4 U12.13(DB20)
TFT_RST: RP7.1 U12.11(RESET)
TFT_VSYNC: RP1.1 U12.37(VSYNC)
NetD6_1: D6.1 L3.1 U14.1(SW)
NetR25_2: R25.2 U14.4(EN)

Not connected (* = marked no-connect by the designer): U12 5(SDO)*; U13 4(NC)* 5(NC)*

### Notes on the sheet
- (near R40) 默认取消硬件的LCD背光使能
- LCD

### Library data of the parts
C55-C59 = CAP
D6 = Diode
L3 = L
R23-R25 R35 R36 R40 = RES
RP1-RP7 = RP
U14 = MP3302: LED驱动IC

## Sheet wireless.SchDoc: Bison-Board
size A4; DrawnBy: mzy2364; Revision: V1.4
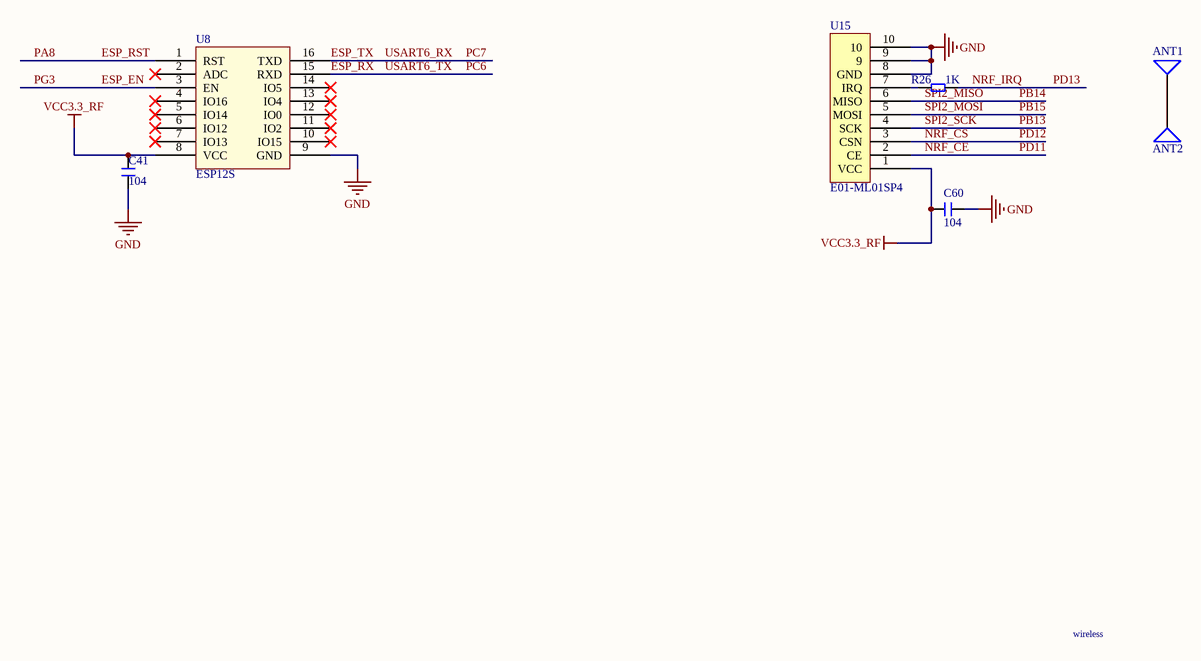
[diagram p7: wireless.SchDoc]

### Parts
ANT1  ANT1  [ANT-SMA-KE]  (value not drawn)
ANT2  ANT  [ANT IPEX]  (value not drawn)
C41  104  [C 0603]
C60  104  [C 0603]
R26  1K  [R 0603]
U8  ESP12S  [ESP12S]
U15  E01-ML01SP4  [E01-ML01SP4]

### Nets
GND: C41.1 C60.2 U8.9(GND) U15.8(GND) U15.9 U15.10
VCC3.3_RF: C41.2 C60.1 U8.8(VCC) U15.1(VCC)
ESP_EN: U8.3(EN)  [also labelled PG3]
ESP_RST: U8.1(RST)  [also labelled PA8]
ESP_RX: U8.15(RXD)  [also labelled PC6, USART6_TX]
ESP_TX: U8.16(TXD)  [also labelled PC7, USART6_RX]
NRF_CE: U15.2(CE)  [also labelled PD11]
NRF_CS: U15.3(CSN)  [also labelled PD12]
NRF_IRQ: R26.1  [also labelled PD13]
PB13: U15.4(SCK)  [also labelled SPI2_SCK]
PB14: U15.6(MISO)  [also labelled SPI2_MISO]
PB15: U15.5(MOSI)  [also labelled SPI2_MOSI]
NetANT1_1: ANT1.1 ANT2.1
NetR26_2: R26.2 U15.7(IRQ)

Not connected (* = marked no-connect by the designer): U8 2(ADC)* 4(IO16)* 5(IO14)* 6(IO12)* 7(IO13)* 10(IO15)* 11(IO2)* 12(IO0)* 13(IO4)* 14(IO5)*

### Notes on the sheet
- wireless

### Library data of the parts
ANT1 = ANT
C41 C60 = CAP
R26 = RES
U8 = ESP12S: WIFI模块
U15 = 24L01: 2.4G无限模块

## Sheet sensor.SchDoc: Bison-Board
size A4; DrawnBy: mzy2364; Revision: V1.4
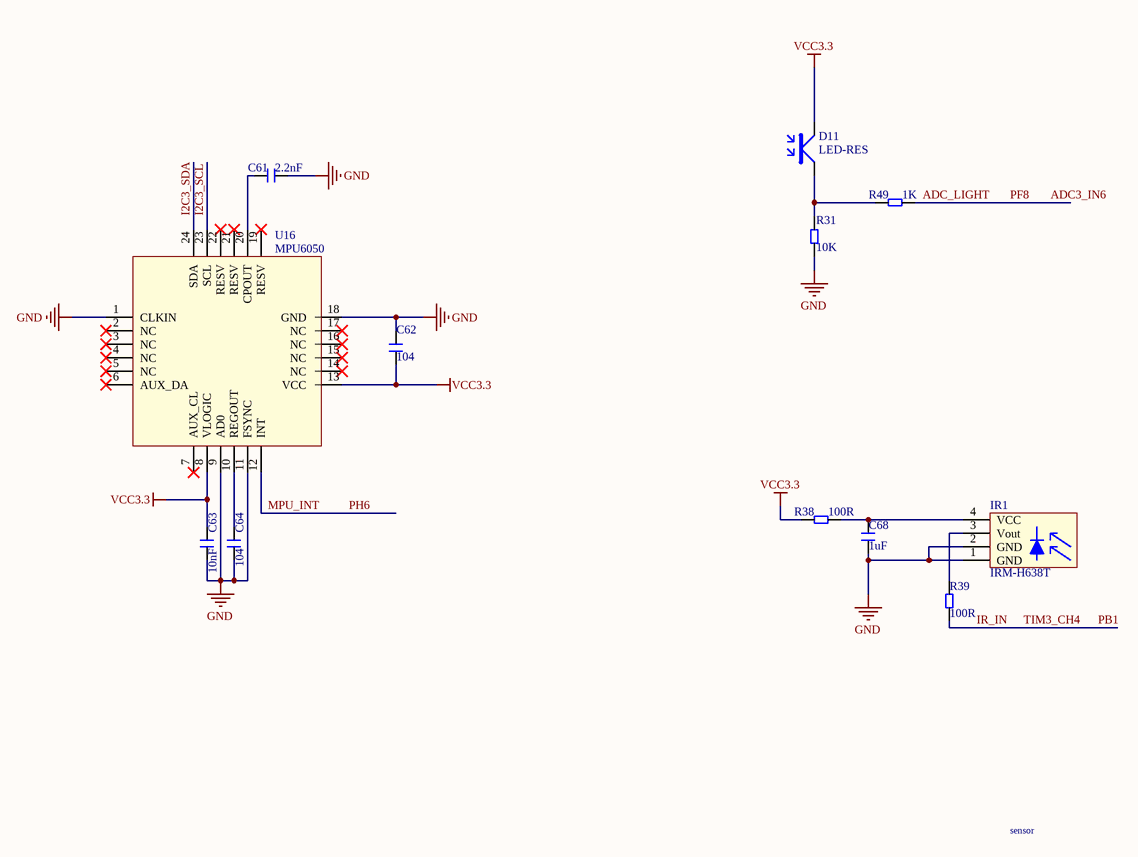
[diagram p8: sensor.SchDoc]

### Parts
C61  2.2nF  [C 0603]
C62  104  [C 0603]
C63  10nF  [C 0603]
C64  104  [C 0603]
C68  1uF  [C 0603]
D11  LED-RES  [LED 0805]
IR1  IRM-H638T  [IRM-H638T]
R31  10K  [R 0603]
R38  100R  [R 0603]
R39  100R  [R 0603]
R49  1K  [R 0603]
U16  MPU6050  [QFN24]

### Nets
GND: C61.2 C62.2 C63.1 C64.1 C68.1 IR1.1(GND) IR1.2(GND) R31.1 U16.1(CLKIN) U16.9(AD0) U16.11(FSYNC) U16.18(GND)
VCC3.3: C62.1 C63.2 D11.2 R38.1 U16.8(VLOGIC) U16.13(VCC)
ADC3_IN6: R49.1  [also labelled ADC_LIGHT, PF8]
I2C3_SCL: U16.23(SCL)
I2C3_SDA: U16.24(SDA)
IR_IN: R39.2  [also labelled PB1, TIM3_CH4]
MPU_INT: U16.12(INT)  [also labelled PH6]
NetC61_1: C61.1 U16.20(CPOUT)
NetC64_2: C64.2 U16.10(REGOUT)
NetC68_2: C68.2 IR1.4(VCC) R38.2
NetD11_1: D11.1 R31.2 R49.2
NetIR1_3: IR1.3(Vout) R39.1

Not connected (* = marked no-connect by the designer): U16 2(NC)* 3(NC)* 4(NC)* 5(NC)* 6(AUX_DA)* 7(AUX_CL)* 14(NC)* 15(NC)* 16(NC)* 17(NC)* 19(RESV)* 21(RESV)* 22(RESV)*

### Notes on the sheet
- sensor

### Library data of the parts
C61-C64 C68 = CAP
D11 = LRES: 光敏传感器
R31 R38 R39 R49 = RES
U16 = MPU6050: 六轴姿态传感器

## Sheet connect.SchDoc: Bison-Board
size A4; DrawnBy: mzy2364; Revision: V1.4
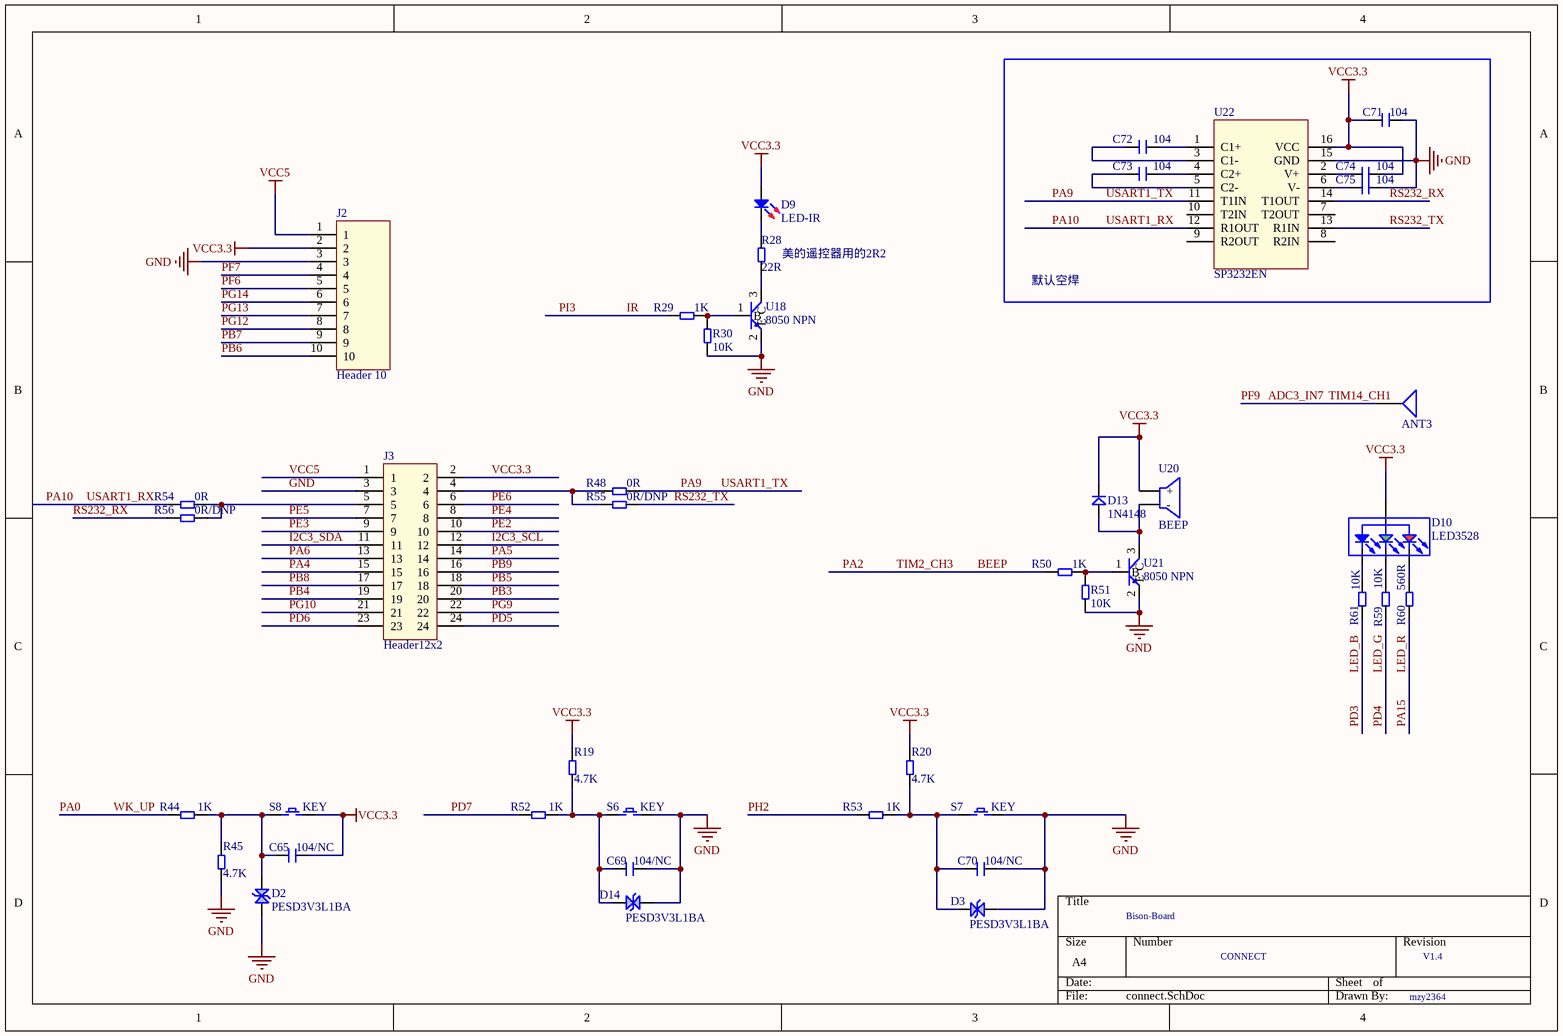
[diagram p9: connect.SchDoc]

### Parts
ANT3  ANT  [ANT IPEX]  (value not drawn)
C65  104/NC  [C 0603]
C69  104/NC  [C 0603]
C70  104/NC  [C 0603]
C71  104  [C 0603]
C72  104  [C 0603]
C73  104  [C 0603]
C74  104  [C 0603]
C75  104  [C 0603]
D2  PESD3V3L1BA  [SOD323]
D3  PESD3V3L1BA  [SOD323]
D9  LED-IR  [IR12-21C]
D10  LED3528  [LED3528-4PIN]
D13  1N4148  [SOD123]
D14  PESD3V3L1BA  [SOD323]
J2  Header 10  [HEADER 10]
J3  Header12x2  [HDR2.54-M-LS-2x12P]
R19  4.7K  [R 0603]
R20  4.7K  [R 0603]
R28  22R  [R 0603]
R29  1K  [R 0603]
R30  10K  [R 0603]
R44  1K  [R 0603]
R45  4.7K  [R 0603]
R48  0R  [R 0603]
R50  1K  [R 0603]
R51  10K  [R 0603]
R52  1K  [R 0603]
R53  1K  [R 0603]
R54  0R  [R 0603]
R55  0R/DNP  [R 0603]
R56  0R/DNP  [R 0603]
R59  10K  [R 0603]
R60  560R  [R 0603]
R61  10K  [R 0603]
S6  KEY  [KEY TSW SMD-6*6*6]
S7  KEY  [KEY TSW SMD-6*6*6]
S8  KEY  [KEY TSW SMD-6*6*6]
U18  8050 NPN  [SOT23-3]
U20  BEEP  [MLT-5020]
U21  8050 NPN  [SOT23-3]
U22  SP3232EN  [TSSOP16]

### Blocks framed on the sheet
默认空焊: C71-C75 U22

### Nets
GND: C69.2 C70.2 C71.1 C75.2 D2.1 D3.2 D14.2 J2.3 J3.3 R30.2 R45.1 R51.2 S6.2 S7.2 U18.2(E) U21.2(E) U22.15(GND)
VCC3.3: C65.2 C71.2 C74.2 D9.1(A) D10.2(+) D13.2 J2.2 J3.2 R19.2 R20.2 S8.2 U20.1(+) U22.16(VCC)
VCC5: J2.1 J3.1
ADC3_IN7: ANT3.1  [also labelled PF9, TIM14_CH1]
BEEP: R50.2  [also labelled PA2, TIM2_CH3]
I2C3_SCL: J3.12
I2C3_SDA: J3.11
IR: R29.2  [also labelled PI3]
LED_B: R61.1  [also labelled PD3]
LED_G: R59.1  [also labelled PD4]
LED_R: R60.1  [also labelled PA15]
PA0: R44.1  [also labelled WK_UP]
PA4: J3.15
PA5: J3.14
PA6: J3.13
PA9: R48.1 U22.11(T1IN)  [also labelled USART1_TX]
PA10: R54.2 U22.12(R1OUT)  [also labelled USART1_RX]
PB3: J3.20
PB4: J3.19
PB5: J3.18
PB6: J2.10
PB7: J2.9
PB8: J3.17
PB9: J3.16
PD5: J3.24
PD6: J3.23
PD7: R52.1
PE2: J3.10
PE3: J3.9
PE4: J3.8
PE5: J3.7
PE6: J3.6
PF6: J2.5
PF7: J2.4
PG9: J3.22
PG10: J3.21
PG12: J2.8  [project net FLASH_SPI_MISO]
PG13: J2.7  [project net FLASH_SPI_CLK]
PG14: J2.6  [project net FLASH_SPI_MOSI]
PH2: R53.1
RS232_RX: R56.2 U22.14(T1OUT)
RS232_TX: R55.1 U22.13(R1IN)
NetC65_1: C65.1 D2.2 R44.2 R45.2 S8.1
NetC69_1: C69.1 D14.1 R19.1 R52.2 S6.1
NetC70_1: C70.1 D3.1 R20.1 R53.2 S7.1
NetC72_1: C72.1 U22.3(C1-)
NetC72_2: C72.2 U22.1(C1+)
NetC73_1: C73.1 U22.5(C2-)
NetC73_2: C73.2 U22.4(C2+)
NetC74_1: C74.1 U22.2(V+)
NetC75_1: C75.1 U22.6(V-)
NetD9_2: D9.2(K) R28.2
NetD10_1: D10.1(R) R60.2
NetD10_3: D10.3(B) R61.2
NetD10_4: D10.4(G) R59.2
NetD13_1: D13.1 U20.2(-) U21.3(C)
NetJ3_4: J3.4 R48.2 R55.2
NetJ3_5: J3.5 R54.1 R56.1
NetR28_1: R28.1 U18.3(C)
NetR29_1: R29.1 R30.1 U18.1(B)
NetR50_1: R50.1 R51.1 U21.1(B)

Not connected (* = marked no-connect by the designer): U22 7(T2OUT) 8(R2IN) 9(R2OUT) 10(T2IN)

### Notes on the sheet
- (near R28) 美的遥控器用的2R2
- CONNECT

### Library data of the parts
C65 C69-C75 = CAP
D2 D3 D14 = D Schottky1: 双向TVS
D13 = Diode
R19 R20 R28-R30 R44 R45 R48 R50-R56 R59-R61 = RES
U18 U21 = NPN

## Nets that join several sheets
GND: MCU (48 pins), POWER (28 pins), USB (15 pins), SDRAM (14 pins), memory (14 pins), LCD (19 pins), wireless (6 pins), sensor (12 pins), connect (17 pins)
VCC3.3: MCU (R21.1 R22.1 R37.2), POWER (C50.2 C51.2 R57.2 U9.5), SDRAM (15 pins), memory (16 pins), LCD (9 pins), sensor (6 pins), connect (13 pins)
VCC3.3_RF: POWER (C53.2 C54.2 U10.5), wireless (C41.2 C60.1 U8.8 U15.1)
VCC5: POWER (7 pins), LCD (C55.2 L3.2 R40.2 U14.5), connect (J2.1 J3.1)
VUSB: POWER (R46.2), USB (C38.2 D12.2 F1.2 U6.7)
ADC3_IN6: MCU (U1.26), sensor (R49.1)
ADC3_IN7: MCU (U1.27), connect (ANT3.1)
ADC123_IN11: MCU (U1.33), POWER (C66.2 R32.1 R33.1)
BEEP: MCU (U1.42), connect (R50.2)
CHRG: MCU (U1.46), POWER (D8.1 R66.2)
ESP_EN: MCU (U1.107), wireless (U8.3)
ESP_RST: MCU (U1.119), wireless (U8.1)
ESP_RX: MCU (U1.115), wireless (U8.15)
ESP_TX: MCU (U1.116), wireless (U8.16)
FLASH_CS: MCU (U1.7), memory (U3.1)
FLASH_SPI_CLK: MCU (U1.156), memory (U3.6), connect (J2.7)
FLASH_SPI_MISO: MCU (U1.155), memory (U3.2), connect (J2.8)
FLASH_SPI_MOSI: MCU (U1.157), memory (U3.5), connect (J2.6)
FMC_A0: MCU (U1.16), SDRAM (U2.23)
FMC_A1: MCU (U1.17), SDRAM (U2.24)
FMC_A2: MCU (U1.18), SDRAM (U2.25)
FMC_A3: MCU (U1.19), SDRAM (U2.26)
FMC_A4: MCU (U1.20), SDRAM (U2.29)
FMC_A5: MCU (U1.21), SDRAM (U2.30)
FMC_A6: MCU (U1.60), SDRAM (U2.31)
FMC_A7: MCU (U1.63), SDRAM (U2.32)
FMC_A8: MCU (U1.64), SDRAM (U2.33)
FMC_A9: MCU (U1.65), SDRAM (U2.34)
FMC_A10: MCU (U1.66), SDRAM (U2.22)
FMC_A11: MCU (U1.67), SDRAM (U2.35)
FMC_A12: MCU (U1.106), SDRAM (U2.36)
FMC_BA0: MCU (U1.108), SDRAM (U2.20)
FMC_BA1: MCU (U1.109), SDRAM (U2.21)
FMC_D0: MCU (U1.104), SDRAM (U2.2)
FMC_D1: MCU (U1.105), SDRAM (U2.4)
FMC_D2: MCU (U1.142), SDRAM (U2.5)
FMC_D3: MCU (U1.143), SDRAM (U2.7)
FMC_D4: MCU (U1.68), SDRAM (U2.8)
FMC_D5: MCU (U1.69), SDRAM (U2.10)
FMC_D6: MCU (U1.70), SDRAM (U2.11)
FMC_D7: MCU (U1.73), SDRAM (U2.13)
FMC_D8: MCU (U1.74), SDRAM (U2.42)
FMC_D9: MCU (U1.75), SDRAM (U2.44)
FMC_D10: MCU (U1.76), SDRAM (U2.45)
FMC_D11: MCU (U1.77), SDRAM (U2.47)
FMC_D12: MCU (U1.78), SDRAM (U2.48)
FMC_D13: MCU (U1.96), SDRAM (U2.50)
FMC_D14: MCU (U1.97), SDRAM (U2.51)
FMC_D15: MCU (U1.98), SDRAM (U2.53)
FMC_NBL0: MCU (U1.169), SDRAM (U2.15)
FMC_NBL1: MCU (U1.170), SDRAM (U2.39)
FMC_SDCKE0: MCU (U1.35), SDRAM (U2.37)
FMC_SDCLK: MCU (U1.112), SDRAM (U2.38)
FMC_SDNCAS: MCU (U1.160), SDRAM (U2.17)
FMC_SDNE0: MCU (U1.34), SDRAM (R34.2 U2.19)
FMC_SDNRAS: MCU (U1.59), SDRAM (U2.18)
FMC_SDNWE: MCU (U1.32), SDRAM (U2.16)
I2C3_SCL: MCU (U1.84), memory (R15.1 U7.6), LCD (R36.1 RP6.7), sensor (U16.23), connect (J3.12)
I2C3_SDA: MCU (U1.85), memory (R16.1 U7.5), LCD (R35.1 RP6.8), sensor (U16.24), connect (J3.11)
IR: MCU (U1.134), connect (R29.2)
IR_IN: MCU (U1.57), sensor (R39.2)
LCD_B3: MCU (U1.154), LCD (RP5.8)
LCD_B4: MCU (U1.173), LCD (RP5.7)
LCD_B5: MCU (U1.174), LCD (RP5.6)
LCD_B6: MCU (U1.175), LCD (RP5.5)
LCD_B7: MCU (U1.176), LCD (RP4.8)
LCD_CLK: MCU (U1.111), LCD (RP1.6)
LCD_DE: MCU (U1.28), LCD (RP1.5)
LCD_G2: MCU (U1.128), LCD (RP4.7)
LCD_G3: MCU (U1.129), LCD (RP4.6)
LCD_G4: MCU (U1.130), LCD (RP4.5)
LCD_G5: MCU (U1.131), LCD (RP3.8)
LCD_G6: MCU (U1.132), LCD (RP3.7)
LCD_G7: MCU (U1.133), LCD (RP3.6)
LCD_HSYNC: MCU (U1.12), LCD (RP1.7)
LCD_PWM: MCU (U1.41), LCD (R23.1 R25.1 R40.1)
LCD_R3: MCU (U1.86), LCD (RP3.5)
LCD_R4: MCU (U1.87), LCD (RP2.8)
LCD_R5: MCU (U1.88), LCD (RP2.7)
LCD_R6: MCU (U1.89), LCD (RP2.6)
LCD_R7: MCU (U1.110), LCD (RP2.5)
LCD_RESET: MCU (U1.53), LCD (RP7.8)
LCD_SPI_CS: MCU (U1.54), LCD (RP7.7)
LCD_SPI_SCL: MCU (U1.55), LCD (RP7.6)
LCD_SPI_SDI: MCU (U1.56), LCD (RP7.5)
LCD_VSYNC: MCU (U1.11), LCD (RP1.8)
LED_B: MCU (U1.145), connect (R61.1)
LED_G: MCU (U1.146), connect (R59.1)
LED_R: MCU (U1.138), connect (R60.1)
MPU_INT: MCU (U1.83), sensor (U16.12)
NRF_CE: MCU (U1.99), wireless (U15.2)
NRF_CS: MCU (U1.100), wireless (U15.3)
NRF_IRQ: MCU (U1.101), wireless (R26.1)
NRF_PWR_EN: MCU (U1.45), POWER (R42.2 U10.3)
PA0: MCU (U1.40), connect (R44.1)
PA3: MCU (U1.47), POWER (D8.4 R67.2)
PA4: MCU (U1.50), connect (J3.15)
PA5: MCU (U1.51), connect (J3.14)
PA6: MCU (U1.52), connect (J3.13)
PA9: MCU (U1.120), USB (U6.4), connect (R48.1 U22.11)
PA10: MCU (U1.121), USB (U6.2), connect (R54.2 U22.12)
PB3: MCU (U1.161), connect (J3.20)
PB4: MCU (U1.162), connect (J3.19)
PB5: MCU (U1.163), connect (J3.18)
PB6: MCU (U1.164), connect (J2.10)
PB7: MCU (U1.165), connect (J2.9)
PB8: MCU (U1.167), connect (J3.17)
PB9: MCU (U1.168), connect (J3.16)
PB10: MCU (U1.79), LCD (RP6.6)
PB11: MCU (U1.80), LCD (RP6.5)
PB12: MCU (U1.92), memory (R27.1 TF1.9)
PB13: MCU (U1.93), wireless (U15.4)
PB14: MCU (U1.94), wireless (U15.6)
PB15: MCU (U1.95), wireless (U15.5)
PC8: MCU (U1.117), memory (R11.2 TF1.7)
PC9: MCU (U1.118), memory (R12.2 TF1.8)
PC10: MCU (U1.139), memory (R8.2 TF1.1)
PC11: MCU (U1.140), memory (R9.2 TF1.2)
PC12: MCU (U1.141), memory (TF1.5)
PC13: MCU (U1.8), POWER (R41.2 R43.1 R65.1)
PD2: MCU (U1.144), memory (R10.2 TF1.3)
PD5: MCU (U1.147), connect (J3.24)
PD6: MCU (U1.150), connect (J3.23)
PD7: MCU (U1.151), connect (R52.1)
PE2: MCU (U1.1), connect (J3.10)
PE3: MCU (U1.2), connect (J3.9)
PE4: MCU (U1.3), connect (J3.8)
PE5: MCU (U1.4), connect (J3.7)
PE6: MCU (U1.5), connect (J3.6)
PF6: MCU (U1.24), connect (J2.5)
PF7: MCU (U1.25), connect (J2.4)
PG9: MCU (U1.152), connect (J3.22)
PG10: MCU (U1.153), connect (J3.21)
PH2: MCU (U1.43), connect (R53.1)
PI11: MCU (U1.13), POWER (R63.2)
USB_N: MCU (U1.122), USB (R13.2)
USB_P: MCU (U1.123), USB (R14.2)